# EAGLE design blink1mk3_arc1 (EAGLE 9.5.2)
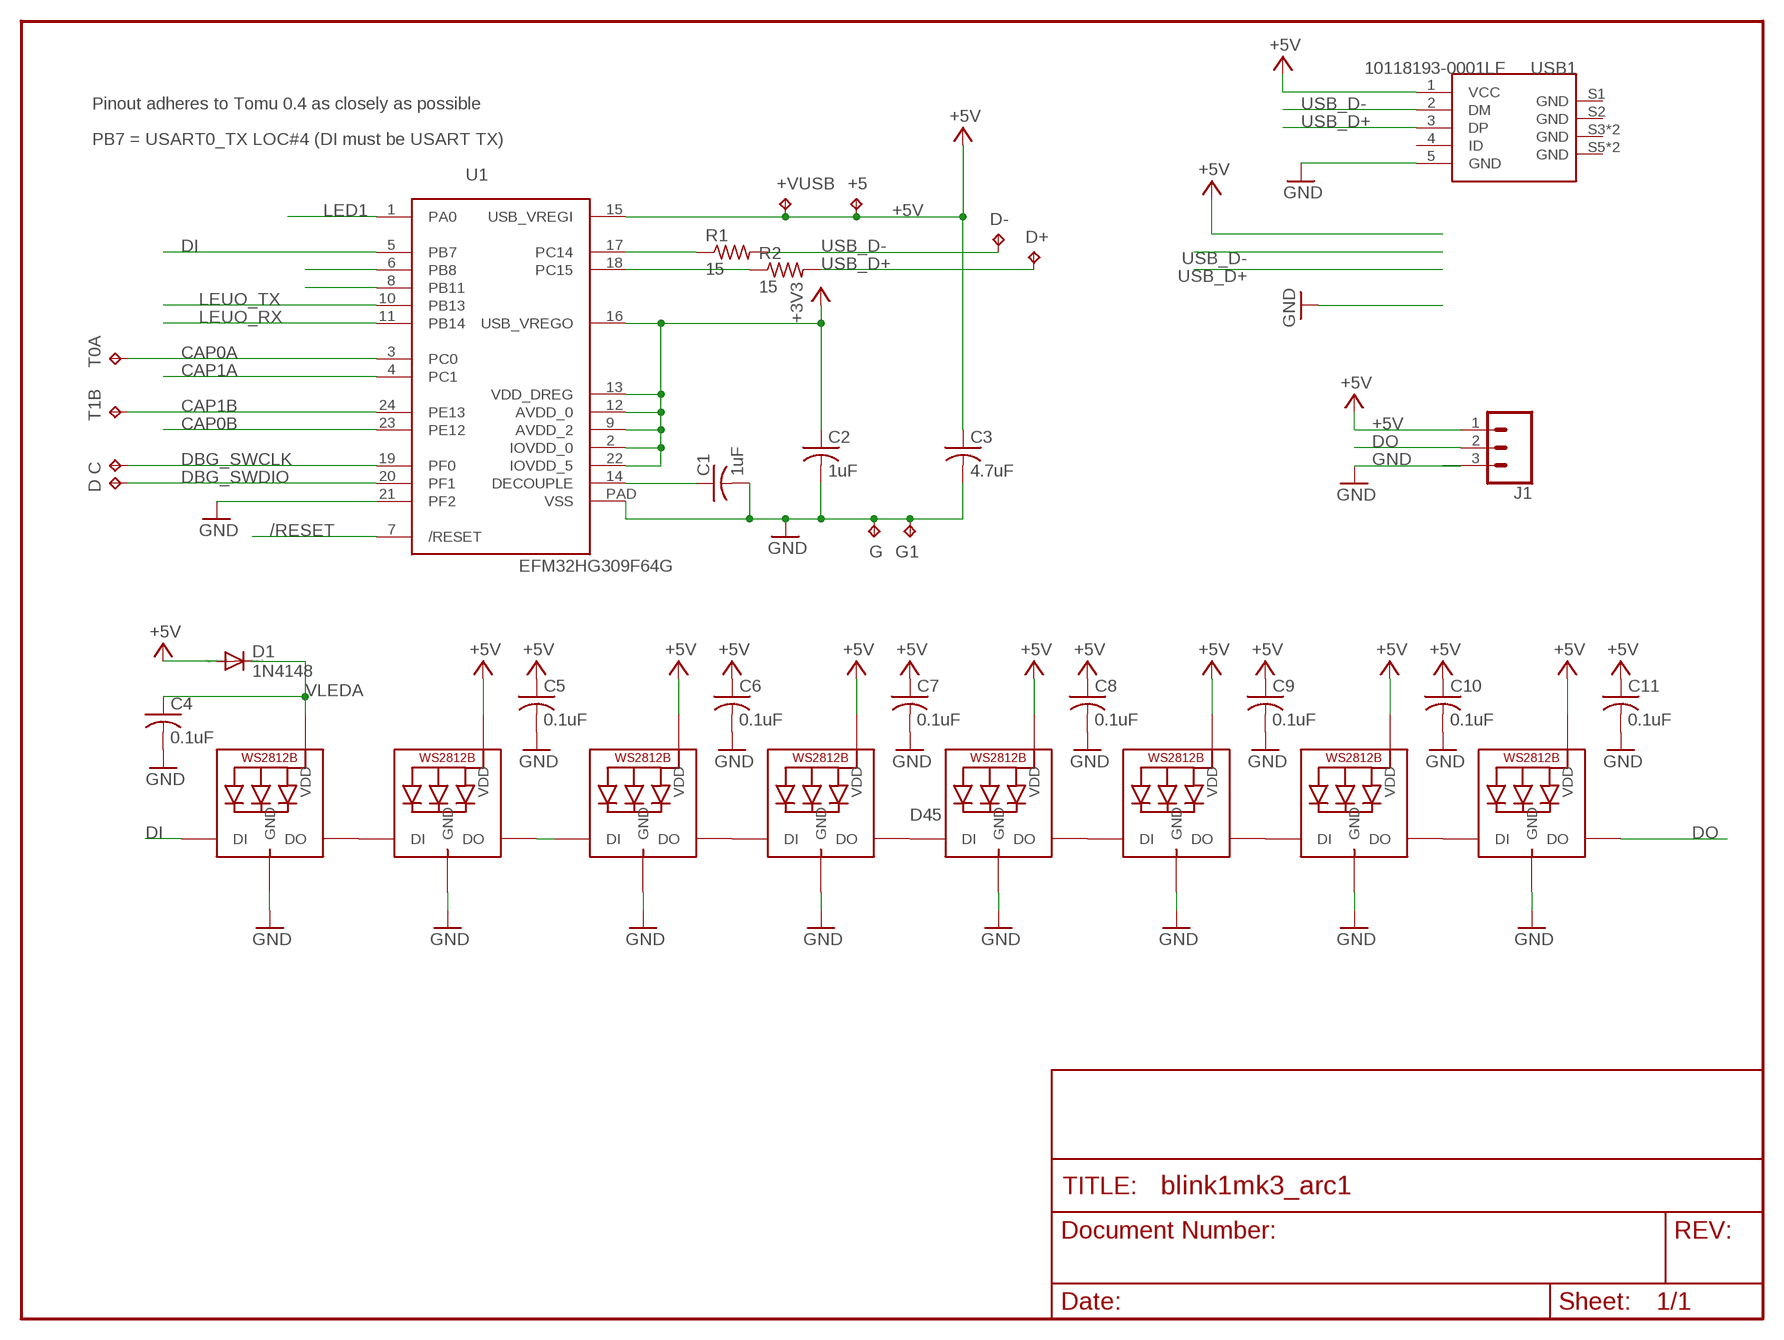
[diagram p0: schematic, sheet 1]

## Parts
+5  TPTP10R  [TP10R]
+VUSB  TPTP10R  [TP10R]
C  TPTP10R  [TP10R]
C1  1uF  C-USC0402  [C0402]
C2  1uF  C-USC0402  [C0402]
C3  4.7uF  C-USC0402  [C0402]
C4  0.1uF  C-USC0402  [C0402]
C5  0.1uF  C-USC0402  [C0402]
C6  0.1uF  C-USC0402  [C0402]
C7  0.1uF  C-USC0402  [C0402]
C8  0.1uF  C-USC0402  [C0402]
C9  0.1uF  C-USC0402  [C0402]
C10  0.1uF  C-USC0402  [C0402]
C11  0.1uF  C-USC0402  [C0402]
D  TPTP10R  [TP10R]
D1  1N4148  DIODE-SOD523  [SOD523]
D+  TPTP10R  [TP10R]
D-  TPTP10R  [TP10R]
G  TPTP10R  [TP10R]
G1  TPTP10R  [TP10R]
J1  CONN_03  [1X03]
LED1  SK6812  WS2812B5050  [WS2812B]
LED2  SK6812  WS2812B5050  [WS2812B]
LED3  SK6812  WS2812B5050  [WS2812B]
LED4  SK6812  WS2812B5050  [WS2812B]
LED5  SK6812  WS2812B5050  [WS2812B]
LED6  SK6812  WS2812B5050  [WS2812B]
LED7  SK6812  WS2812B5050  [WS2812B]
LED8  SK6812  WS2812B5050  [WS2812B]
R1  15  R-US_R0402  [R0402]
R2  15  R-US_R0402  [R0402]
T0A  TPTP15R  [TP15R]
T1B  TPTP15R  [TP15R]
U1  EFM32HG309F64G  [QFN24PAD]
USB1  10118193-0001LF  MICRO-USB-SMD-B-(10118193-0001LF)  [MICRO-USB5+6P-SMD-0.65-B]

## Nets
+3V3: C2.1 U1.2(IOVDD_0) U1.9(AVDD_2) U1.12(AVDD_0) U1.13(VDD_DREG) U1.16(USB_VREGO) U1.22(IOVDD_5)
+5V: +5.TP +VUSB.TP C3.1 C5.1 C6.1 C7.1 C8.1 C9.1 C10.1 C11.1 D1.A J1.1 LED2.1-VDD(VDD) LED3.1-VDD(VDD) LED4.1-VDD(VDD) LED5.1-VDD(VDD) LED6.1-VDD(VDD) LED7.1-VDD(VDD) LED8.1-VDD(VDD) U1.15(USB_VREGI) USB1.1(VCC)
/RESET: U1.7(/RESET)
CAP0A: T0A.TP U1.3(PC0)
CAP0B: U1.23(PE12)
CAP1A: U1.4(PC1)
CAP1B: T1B.TP U1.24(PE13)
D45: LED4.2-DOUT(DO) LED5.4-DIN(DI)
DBG_SWCLK: C.TP U1.19(PF0)
DBG_SWDIO: D.TP U1.20(PF1)
DECOUPLE: C1.1 U1.14(DECOUPLE)
DI: LED1.4-DIN(DI) U1.5(PB7)
DO: J1.2 LED8.2-DOUT(DO)
GND: C1.2 C2.2 C3.2 C4.2 C5.2 C6.2 C7.2 C8.2 C9.2 C10.2 C11.2 G1.TP G.TP J1.3 LED1.3-GND(GND) LED2.3-GND(GND) LED3.3-GND(GND) LED4.3-GND(GND) LED5.3-GND(GND) LED6.3-GND(GND) LED7.3-GND(GND) LED8.3-GND(GND) U1.21(PF2) U1.PAD(VSS) USB1.5(GND)
LED1: U1.1(PA0)
LEUO_RX: U1.11(PB14)
LEUO_TX: U1.10(PB13)
N$1: U1.8(PB11)
N$2: LED1.2-DOUT(DO) LED2.4-DIN(DI)
N$3: U1.6(PB8)
N$4: LED3.2-DOUT(DO) LED4.4-DIN(DI)
N$5: LED5.2-DOUT(DO) LED6.4-DIN(DI)
N$6: LED7.2-DOUT(DO) LED8.4-DIN(DI)
N$7: LED6.2-DOUT(DO) LED7.4-DIN(DI)
N$8: LED2.2-DOUT(DO) LED3.4-DIN(DI)
RUSB_D+: R2.1 U1.18(PC15)
RUSB_D-: R1.1 U1.17(PC14)
USB_D+: D+.TP R2.2 USB1.3(DP)
USB_D-: D-.TP R1.2 USB1.2(DM)
VLEDA: C4.1 D1.C LED1.1-VDD(VDD)
Unconnected: USB1.4(ID) USB1.S1(GND) USB1.S2(GND) USB1.S3(GND) USB1.S4(GND) USB1.S5(GND) USB1.S6(GND)

## Notes on the sheet
- Pinout adheres to Tomu 0.4 as closely as possible
- PB7 = USART0_TX LOC#4 (DI must be USART TX)

## Library data of the parts
+5 +VUSB C D D+ D- G G1 T0A T1B = testpad:TP: Test pad
C1-C11 = adafruit:C-US: CAPACITOR, American symbol
D1 = diode:DIODE-: DIODE
J1 = SparkFun-Connectors:CONN_03: Multi connection point. Often used as Generic Header-pin footprint for 0.1 inch spaced/style header connections On any of the 0.1 inch spaced packages, you can populate with these: Break Away Headers - Straight <https://www.sparkfun.com/products/116> (PRT-00116) Break Away Male Headers - Right Angle <https://www.sparkfun.com/products/553> (PRT-00553) Female Headers <https://www.sparkfun.com/products/115> (PRT-00115) Break Away Headers - Machine Pin <https://www.sparkfun.com/products/117> (PRT-00117) Break Away Female Headers - Swiss Machine Pin <https://www.sparkfun.com/products/743> (PRT-00743) Stackable Header - 3 Pin (Female, 0.1") <https://www.sparkfun.com/products/13875> (PRT-13875) For SCREWTERMINALS and SPRING TERMINALS visit here: Screw Terimnals on SparkFun.com <https://www.sparkfun.com/search/results?term=Screw+Terminals> (5mm/3.5mm/2.54mm spacing) This device is also useful as a general connection point to wire up your design to another part of your project. Our various solder wires solder well into these plated through hole pads. Hook-Up Wire - Assortment (Stranded, 22 AWG) <https://www.sparkfun.com/products/11375> (PRT-11375) Hook-Up Wire - Assortment (Solid Core, 22 AWG) <https://www.sparkfun.com/products/11367> (PRT-11367) View the entire wire category on our website here <https://www.sparkfun.com/categories/141> Special notes: Molex polarized connector foot print use with SKU : PRT-08232 with associated crimp pins and housings.
LED1-LED8 = adafruit:WS2812B
R1 R2 = adafruit:R-US_: RESISTOR, American symbol
U1 = todstuff:EFM32HG309F64G
USB1 = Seeed-Connector:MICRO-USB-SMD-B-(10118193-0001LF): 320010003; MPN: 10118193-0001LF

## Board
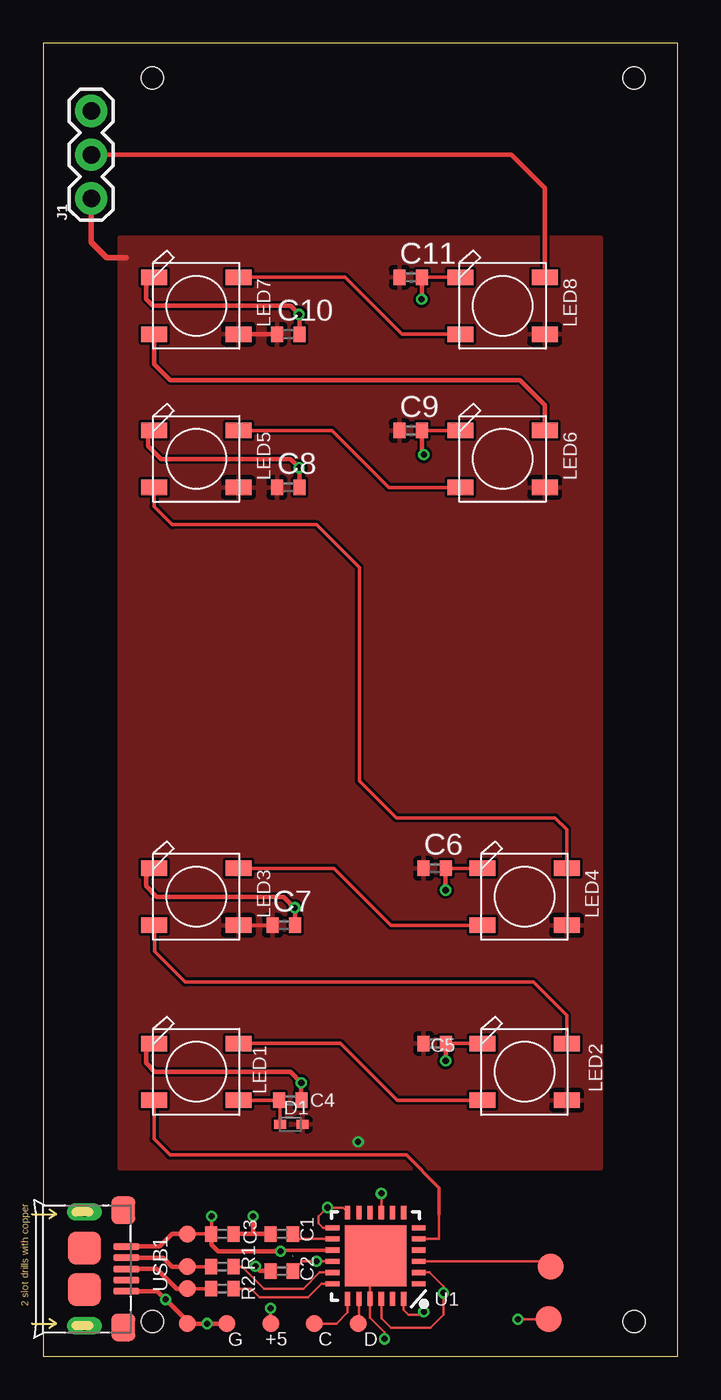
[diagram p1: board, top side]
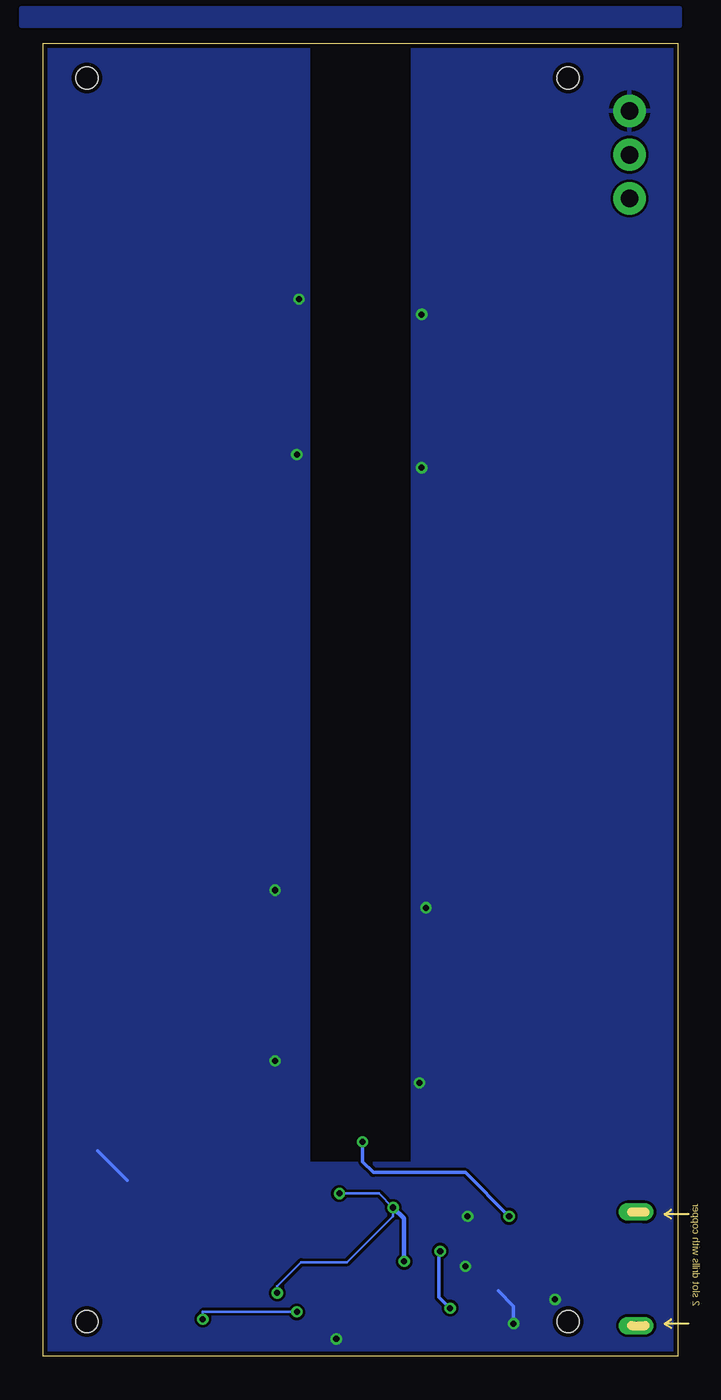
[diagram p2: board, bottom side, seen from below]

Size 36.83 x 76.2 mm. Coordinates in mm from the lower left corner, seen from the top.
Outline: 0,0 36.83,0 36.83,76.2 0,76.2 0,0
Copper layers (1*16): Top 0.035mm / dielectric 0.785mm / Bottom 0.035mm
Design rules "SeeedStudio_2layer_DRU_no_angle_20140221_blink1thin *": minimum track width 6mil, minimum drill 12mil, track to track 6mil, track to pad 6mil, pad to pad 6mil, via to via 6mil, smd to smd 0mil, copper to edge 10mil, drill to drill 10mil, minimum pad ring 10mil, minimum via ring 6mil, stop-mask expansion 2mil, vias tented up to drill 100mil, thermal gap 10mil
Holes 1.27 mm at 34.29,74.17 34.29,2.03 6.35,2.03 6.35,74.17

### Footprints (pad centres in the part's own frame; a part is rotated, then mirrored left to right if it is on the bottom)
TP10R = smd 1 x 1: TP 0,0
C0402 = smd 0.7 x 0.9: 1 -0.65,0; 2 0.65,0
SOD523 = smd 0.7 x 0.5: A 0.7,0; C -0.6,0
1X03 = drill 1.016 pad 1.88: 1 0,0; 2 2.54,0; 3 5.08,0
WS2812B = smd 1.5 x 0.9: 1-VDD 2.45,-1.65; 2-DOUT 2.45,1.65; 3-GND -2.45,1.65; 4-DIN -2.45,-1.65
R0402 = smd 0.7 x 0.9: 1 -0.65,0; 2 0.65,0
TP15R = smd 1.5 x 1.5: TP 0,0
QFN24PAD = smd 0.8 x 0.3: 1 -2.5,1.625; 2 -2.5,0.975; 3 -2.5,0.325; 4 -2.5,-0.325; 5 -2.5,-0.975; 6 -2.5,-1.625; 13 2.5,-1.625; 14 2.5,-0.975; 15 2.5,-0.325; 16 2.5,0.325; 17 2.5,0.975; 18 2.5,1.625 | smd 0.3 x 0.8: 7 -1.625,-2.5; 8 -0.975,-2.5; 9 -0.325,-2.5; 10 0.325,-2.5; 11 0.975,-2.5; 12 1.625,-2.5; 19 1.625,2.5; 20 0.975,2.5; 21 0.325,2.5; 22 -0.325,2.5; 23 -0.975,2.5; 24 -1.625,2.5 | smd 3.55 x 3.55: PAD 0,0
MICRO-USB5+6P-SMD-0.65-B = smd 0.4 x 1.5: 1 -1.3,-0.25; 2 -0.65,-0.25; 3 0,-0.25; 4 0.65,-0.25; 5 1.3,-0.25 | smd 1.6 x 1.4: S1 -3.4,-0.427; S6 3.4,-0.427 | drill 0.508 pad 1.016 long: S2 -3.3,-2.675; S5 3.3,-2.675 | smd 1.9 x 1.9: S3 -1.2,-2.675; S4 1.2,-2.675

### Placement (x,y rotation side)
+5  13.21,1.91 90 top
+VUSB  8.38,7.11 0 top
C  15.75,1.91 90 top
C1  13.84,7.11 180 top
C2  13.84,4.95 180 top
C3  10.41,7.11 0 top
C4  14.35,14.86 0 top
C5  22.73,18.16 0 top
C6  22.73,28.32 0 top
C7  13.97,25.02 0 top
C8  14.22,50.42 0 top
C9  21.34,53.72 0 top
C10  14.22,59.31 0 top
C11  21.34,62.61 0 top
D  18.29,1.91 90 top
D1  14.35,13.46 0 top
D+  8.38,3.94 0 top
D-  8.38,5.21 0 top
G  10.67,1.91 270 top
G1  8.38,1.91 0 top
J1  2.79,67.18 90 top
LED1  8.89,16.51 0 top
LED2  27.94,16.51 0 top
LED3  8.89,26.67 0 top
LED4  27.94,26.67 0 top
LED5  8.89,52.07 0 top
LED6  26.67,52.07 0 top
LED7  8.89,60.96 0 top
LED8  26.67,60.96 0 top
R1  10.41,5.21 180 top
R2  10.41,3.94 180 top
T0A  29.46,5.21 90 top
T1B  29.34,2.16 270 top
U1  19.3,5.84 180 top
USB1  5.08,5.08 270 top

### Tracks (layer width: path | path; a pad name or v marks a point on that pad's centre or on a via)
+3V3  (via drill 0.35)
  Top 0.152: U1.16 v15.88,5.52 15.06,5.52 C2.1 | U1.22 19.63,2.21 20.19,1.65 22.48,1.65 23.24,2.41 v23.24,3.68 23.24,4.06 22.44,4.87 U1.2 | U1.13 16.26,7.47 16,7.72 16,8.13 v16.51,8.64 17.4,8.64 17.68,8.36 U1.12 | U1.9 v19.63,9.45
  Bottom 0.152: v23.24,3.68 23.24,4.06 21.84,5.46 19.18,5.46 16.51,8.13 v16.51,8.64 17.33,9.45 v19.63,9.45
  Bottom 0.254: v15.88,5.52 15.88,8 v16.51,8.64
+5V  (via drill 0.35)
  Top 0.203: v13.78,6.1 13.85,6.17 U1.15 | v9.78,8.13 9.78,7.13 C3.1 +VUSB.TP | LED3.1-VDD C7.1 | v13.21,2.79 +5.TP
  Top 0.254: +VUSB.TP 7.49,7.11 6.76,6.38 USB1.1 | C3.1 9.78,7.1 9.78,6.48 10.16,6.1 v13.78,6.1 | LED7.1-VDD C10.1
  Top 0.305: J1.1 2.79,64.64 3.68,63.75 4.83,63.75
  Bottom 0.203: v13.78,6.1 13.84,6.04 13.84,3.43 v13.21,2.79 | v9.78,8.13 12.32,10.67 17.65,10.67 18.29,11.3 v18.29,12.45
  pour Top: 4.45,64.9 32.38,64.9 32.38,10.92 4.45,10.92
CAP0A
  Top 0.152: T0A.TP 29.15,5.52 U1.3
CAP1B  (via drill 0.35)
  Top 0.152: U1.24 20.93,2.69 21.21,2.41 21.92,2.41 v22.1,2.59 | T1B.TP v27.56,2.16
  Bottom 0.152: v22.1,2.59 27.56,2.59 v27.56,2.16
D45
  Top 0.203: LED4.2-DOUT 30.39,30.57 29.72,31.24 20.51,31.24 18.35,33.4 18.35,45.78 15.88,48.26 7.49,48.26 6.44,49.31 LED5.4-DIN
DBG_SWCLK
  Top 0.152: U1.19 17.68,2.57 17.02,1.91 C.TP
DBG_SWDIO
  Top 0.152: D.TP 18.33,1.95 U1.20
DECOUPLE
  Top 0.152: U1.14 14.79,6.82 C1.1
DI
  Top 0.152: U1.5 22.99,6.82 22.99,8.26
  Top 0.203: LED1.4-DIN 6.44,12.61 7.37,11.68 21.08,11.68 22.99,9.78 22.99,8.26
DO
  Top 0.254: LED8.2-DOUT 29.12,67.78 27.18,69.72 J1.2
GND  (via drill 0.35)
  Top 0.152: 10.29,1.91 G.TP | 19.3,4.57 19.3,4.83 | 19.3,4.83 U1.PAD | v19.81,1.02 19.81,1.4 18.98,2.23 U1.21 18.98,4.5 19.3,4.83
  Top 0.203: C5.2 LED2.3-GND | C6.2 LED4.3-GND | C11.2 LED8.3-GND | C9.2 LED6.3-GND
  Top 0.254: C2.2 12.6,4.95 v12.32,5.23 | C3.2 12.32,7.11 | 12.32,7.11 C1.2 | 12.32,7.11 12.19,7.24 v12.19,8.13 | G.TP v9.53,1.91 G1.TP 8.38,2.03 v7.11,3.3 6.63,3.78 USB1.5 | C7.2 14.62,26.02 v14.61,26.04 13.97,26.67 6.6,26.67 5.97,27.3 5.97,27.85 LED3.3-GND | C5.2 23.38,17.16 v23.37,17.14 | C6.2 23.37,28.31 v23.37,27.05 | C9.2 21.99,52.44 v22.1,52.32 | LED5.3-GND 6.1,53.38 6.1,52.83 6.86,52.07 14.35,52.07 v14.86,51.56 14.87,51.55 C8.2 | LED1.3-GND 5.97,17.69 5.97,17.02 6.48,16.51 14.35,16.51 v14.99,15.88 14.99,14.87 C4.2 | C11.2 21.99,61.36 v21.97,61.34 | C10.2 14.87,60.44 v14.86,60.45 14.35,60.96 6.35,60.96 5.97,61.34 5.97,62.14 LED7.3-GND
  Bottom 0.203: 31.94,10.22 33.66,11.94 | v9.53,1.91 9.53,2.92 10.41,3.81
  pour Bottom: -0.25,11.18 37.21,11.18 37.21,-0.51 -0.25,-0.51
  pour Bottom: -0.13,78.23 38.1,78.23 38.1,77.22 -0.13,77.22
  pour Bottom: 0,76.2 15.37,76.2 15.37,10.79 0,10.79
  pour Bottom: 21.46,76.2 36.83,76.2 36.83,10.79 21.46,10.79
N$2
  Top 0.203: LED2.4-DIN 20.57,14.86 17.27,18.16 LED1.2-DOUT
N$4
  Top 0.203: LED4.4-DIN 20.19,25.02 16.89,28.32 LED3.2-DOUT
N$5
  Top 0.203: LED6.4-DIN 20.07,50.42 16.76,53.72 LED5.2-DOUT
N$6
  Top 0.203: LED8.4-DIN 20.83,59.31 17.53,62.61 LED7.2-DOUT
N$7
  Top 0.254: LED6.2-DOUT 29.12,55.21 27.69,56.64 7.37,56.64 6.44,57.57 LED7.4-DIN
N$8
  Top 0.203: LED2.2-DOUT 30.39,19.77 28.45,21.72 8.26,21.72 6.48,23.5 6.48,24.98 LED3.4-DIN
RUSB_D+
  Top 0.152: R2.1 12.06,3.94 12.57,3.43 15.37,3.43 16.16,4.22 U1.18
RUSB_D-
  Top 0.152: U1.17 16.04,4.87 15.11,3.94 12.83,3.94 11.56,5.21 R1.1
USB_D+
  Top 0.203: D+.TP R2.2
  Top 0.254: USB1.3 6.6,5.08 7.75,3.94 D+.TP
USB_D-
  Top 0.203: D-.TP R1.2
  Top 0.254: USB1.2 6.97,5.73 7.49,5.21 D-.TP
VLEDA
  Top 0.203: LED1.1-VDD C4.1 13.75,14.81 D1.C